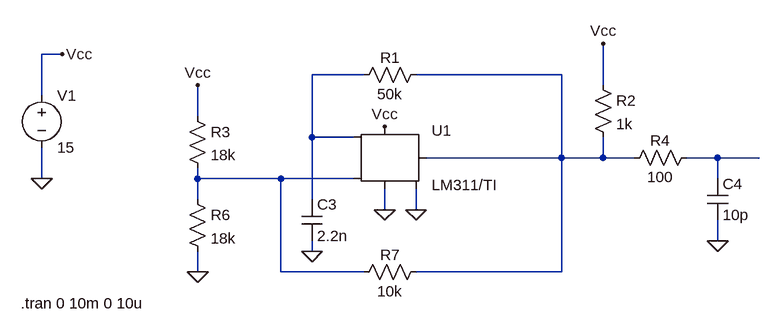
[diagram p0: schematic oscilador-clase-paura.asc]
oscilador-clase-paura.asc, the LTspice schematic file:
Version 4
SHEET 1 880 680
WIRE -304 16 -336 16
WIRE 160 48 80 48
WIRE 464 48 240 48
WIRE 528 64 528 0
WIRE -336 80 -336 16
WIRE -96 112 -96 64
WIRE 80 144 80 48
WIRE 144 144 80 144
WIRE 464 176 464 48
WIRE 464 176 256 176
WIRE 528 176 528 144
WIRE 528 176 464 176
WIRE 576 176 528 176
WIRE 704 176 656 176
WIRE 768 176 704 176
WIRE -336 208 -336 160
WIRE -96 208 -96 192
WIRE 32 208 -96 208
WIRE 144 208 32 208
WIRE 704 208 704 176
WIRE -96 240 -96 208
WIRE 80 240 80 144
WIRE 192 256 192 224
WIRE 240 256 240 224
WIRE 704 304 704 272
WIRE 80 320 80 304
WIRE -96 352 -96 320
WIRE 32 352 32 208
WIRE 160 352 32 352
WIRE 464 352 464 176
WIRE 464 352 240 352
FLAG 240 256 0
FLAG -96 352 0
FLAG -96 64 Vcc
FLAG 192 128 Vcc
FLAG 192 256 0
FLAG 80 320 0
FLAG 528 0 Vcc
FLAG 704 304 0
FLAG -336 208 0
FLAG -304 16 Vcc
SYMBOL TCLib\\LM311 336 128 R0
SYMATTR InstName U1
SYMBOL res -112 96 R0
SYMATTR InstName R3
SYMATTR Value 18k
SYMBOL res -112 224 R0
SYMATTR InstName R6
SYMATTR Value 18k
SYMBOL res 144 368 R270
WINDOW 0 27 56 VTop 2
WINDOW 3 2 56 VBottom 2
SYMATTR InstName R7
SYMATTR Value 10k
SYMBOL res 144 64 R270
WINDOW 0 27 56 VTop 2
WINDOW 3 2 56 VBottom 2
SYMATTR InstName R1
SYMATTR Value 50k
SYMBOL cap 64 240 R0
SYMATTR InstName C3
SYMATTR Value 2.2n
SYMBOL res 560 192 R270
WINDOW 0 27 56 VTop 2
WINDOW 3 2 56 VBottom 2
SYMATTR InstName R4
SYMATTR Value 100
SYMBOL res 512 48 R0
SYMATTR InstName R2
SYMATTR Value 1k
SYMBOL cap 688 208 R0
SYMATTR InstName C4
SYMATTR Value 10p
SYMBOL voltage -336 64 R0
SYMATTR InstName V1
SYMATTR Value 15
TEXT -368 400 Left 2 !.tran 0 10m 0 10u

The netlist it stands for:
* oscilador-clase-paura.asc
XU1 N004 N001 Vcc 0 N002 0 LM311/TI
R3 Vcc N004 18k
R6 N004 0 18k
R7 N004 N002 10k
R1 N001 N002 50k
C3 N001 0 2.2n
R4 N002 N003 100
R2 Vcc N002 1k
C4 N003 0 10p
V1 Vcc 0 15
.tran 0 10m 0 10u
.lib LM311.lib
.backanno
.end